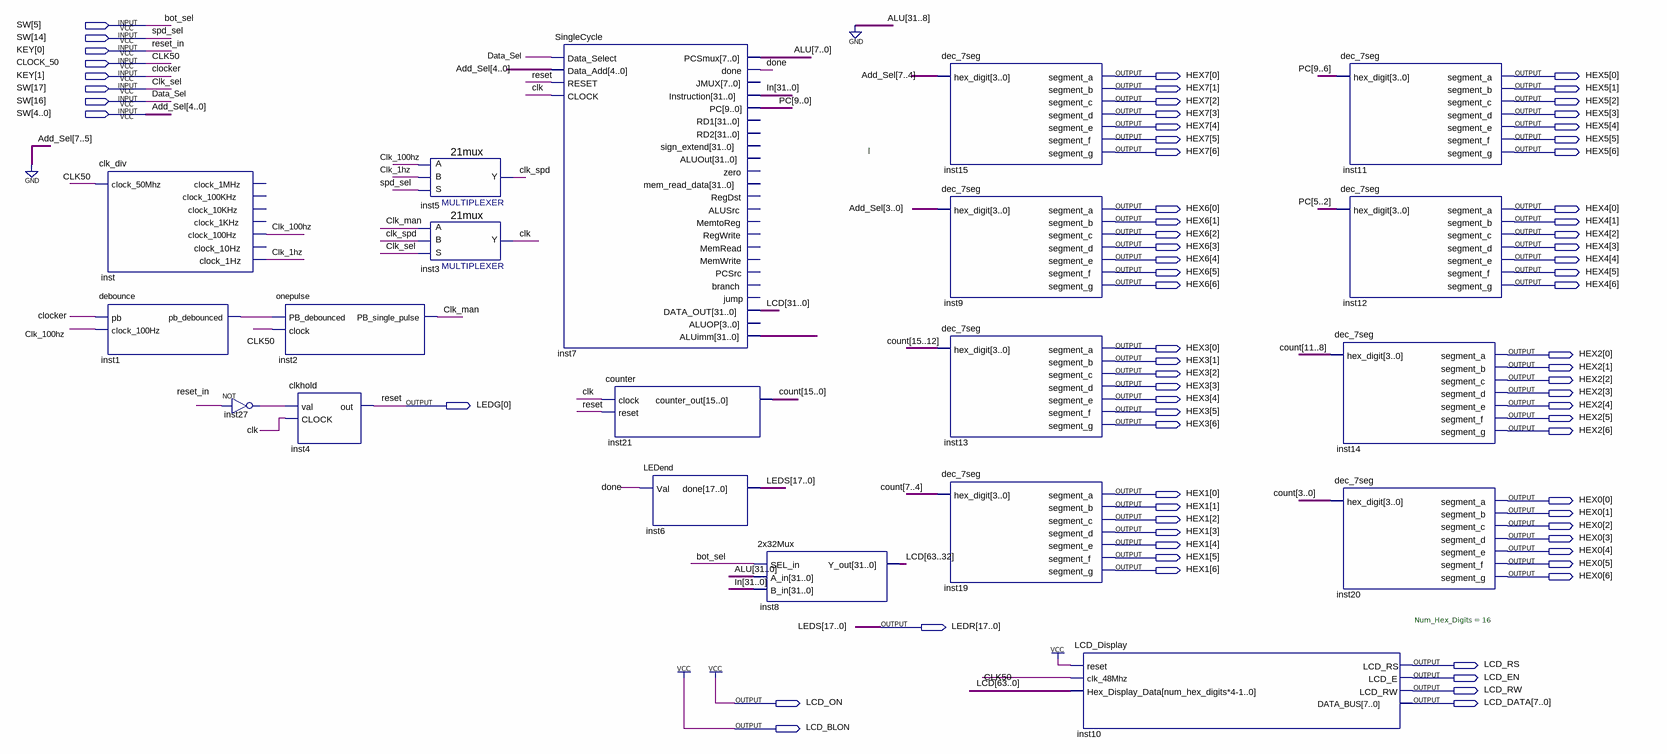
[diagram p0: schematic sheet]
// Quartus schematic board.bdf as structural Verilog: 20 symbols, 72 pins
module board (
  input  [17:0] SW,
  input  [1:0] KEY,
  input  CLOCK_50,
  output [6:0] HEX7,
  output [6:0] HEX5,
  output [6:0] HEX6,
  output [6:0] HEX4,
  output [6:0] HEX3,
  output [6:0] HEX2,
  output [0:0] LEDG,
  output [6:0] HEX1,
  output [6:0] HEX0,
  output [17:0] LEDR,
  output LCD_RS,
  output LCD_EN,
  output LCD_RW,
  output LCD_ON,
  output [7:0] LCD_DATA,
  output LCD_BLON
);

  wire clk, Clk_1hz, Clk_100hz, Clk_man, clk_spd, done, inst1_pb_debounced, inst27_out;
  wire [7:0] ALU;
  wire [9:0] PC;
  wire [15:0] count;
  wire [31:0] In, inst7_aluimm;
  wire [63:0] LCD;

  clk_div inst (
    .clock_50Mhz(CLOCK_50), .clock_100Hz(Clk_100hz), .clock_1Hz(Clk_1hz));  // open: clock_1MHz, clock_100KHz, clock_10KHz, clock_1KHz, clock_10Hz
  debounce inst1 (.pb(KEY[1]), .clock_100Hz(Clk_100hz), .pb_debounced(inst1_pb_debounced));
  not inst27 (inst27_out, KEY[0]);
  onepulse inst2 (.PB_debounced(inst1_pb_debounced), .clock(CLOCK_50), .PB_single_pulse(Clk_man));
  clkhold inst4 (.val(inst27_out), .CLOCK(clk), .out(LEDG[0]));
  \21mux  inst5 (.S(SW[14]), .B(Clk_1hz), .A(Clk_100hz), .Y(clk_spd));
  \21mux  inst3 (.S(SW[17]), .B(clk_spd), .A(Clk_man), .Y(clk));
  SingleCycle inst7 (
    .Data_Select(SW[16]), .Data_Add(SW[4:0]), .RESET(LEDG[0]), .CLOCK(clk), .PCSmux(ALU), .done(done),
    .Instruction(In), .PC(PC), .DATA_OUT(LCD[31:0]), .ALUimm(inst7_aluimm));  // open: JMUX, RD1, RD2, sign_extend, ALUOut, zero, mem_read_data, RegDst, ALUSrc, MemtoReg, RegWrite, MemRead, MemWrite, PCSrc, branch, jump, ALUOP
  counter inst21 (.clock(clk), .reset(LEDG[0]), .counter_out(count));
  LEDend inst6 (.Val(done), .done(LEDR));
  \2x32Mux  inst8 (.SEL_in(SW[5]), .A_in({{24{1'b0}}, ALU}), .B_in(In), .Y_out(LCD[63:32]));
  dec_7seg inst15 (
    .hex_digit({3'b000, SW[4]}), .segment_a(HEX7[0]), .segment_b(HEX7[1]), .segment_c(HEX7[2]),
    .segment_d(HEX7[3]), .segment_e(HEX7[4]), .segment_f(HEX7[5]), .segment_g(HEX7[6]));
  dec_7seg inst9 (
    .hex_digit(SW[3:0]), .segment_a(HEX6[0]), .segment_b(HEX6[1]), .segment_c(HEX6[2]), .segment_d(HEX6[3]),
    .segment_e(HEX6[4]), .segment_f(HEX6[5]), .segment_g(HEX6[6]));
  dec_7seg inst13 (
    .hex_digit(count[15:12]), .segment_a(HEX3[0]), .segment_b(HEX3[1]), .segment_c(HEX3[2]),
    .segment_d(HEX3[3]), .segment_e(HEX3[4]), .segment_f(HEX3[5]), .segment_g(HEX3[6]));
  dec_7seg inst19 (
    .hex_digit(count[7:4]), .segment_a(HEX1[0]), .segment_b(HEX1[1]), .segment_c(HEX1[2]),
    .segment_d(HEX1[3]), .segment_e(HEX1[4]), .segment_f(HEX1[5]), .segment_g(HEX1[6]));
  LCD_Display #(.Num_Hex_Digits(16)) inst10 (
    .reset(1'b1), .clk_48Mhz(CLOCK_50), .Hex_Display_Data(LCD), .LCD_RS(LCD_RS), .LCD_E(LCD_EN),
    .LCD_RW(LCD_RW), .DATA_BUS(LCD_DATA));
  dec_7seg inst11 (
    .hex_digit(PC[9:6]), .segment_a(HEX5[0]), .segment_b(HEX5[1]), .segment_c(HEX5[2]), .segment_d(HEX5[3]),
    .segment_e(HEX5[4]), .segment_f(HEX5[5]), .segment_g(HEX5[6]));
  dec_7seg inst12 (
    .hex_digit(PC[5:2]), .segment_a(HEX4[0]), .segment_b(HEX4[1]), .segment_c(HEX4[2]), .segment_d(HEX4[3]),
    .segment_e(HEX4[4]), .segment_f(HEX4[5]), .segment_g(HEX4[6]));
  dec_7seg inst14 (
    .hex_digit(count[11:8]), .segment_a(HEX2[0]), .segment_b(HEX2[1]), .segment_c(HEX2[2]),
    .segment_d(HEX2[3]), .segment_e(HEX2[4]), .segment_f(HEX2[5]), .segment_g(HEX2[6]));
  dec_7seg inst20 (
    .hex_digit(count[3:0]), .segment_a(HEX0[0]), .segment_b(HEX0[1]), .segment_c(HEX0[2]),
    .segment_d(HEX0[3]), .segment_e(HEX0[4]), .segment_f(HEX0[5]), .segment_g(HEX0[6]));

  assign LCD_BLON = 1'b1;
  assign LCD_ON = 1'b1;

  // Other names for the same wires on the sheet: Add_Sel[4:0] = SW[4:0]; bot_sel = SW[5]; CLK50 = CLOCK_50;
  //   Clk_sel = SW[17]; clocker = KEY[1]; Data_Sel = SW[16]; LEDS[17:0] = LEDR; reset = LEDG[0]; reset_in = KEY[0];
  //   spd_sel = SW[14]

  // Notes on the sheet:
  //   l
endmodule
